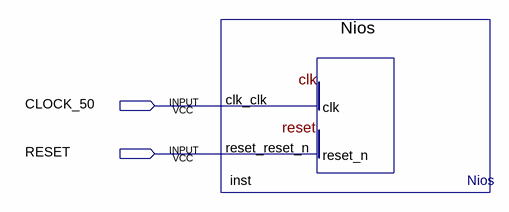
[diagram p0: schematic sheet]
// Quartus schematic TOP.bdf as structural Verilog: 1 symbols, 2 pins
module TOP (
  input  CLOCK_50,
  input  RESET
);

  Nios inst (.clk_clk(CLOCK_50), .reset_reset_n(RESET));
endmodule
